# EAGLE design BEP32_90Grad (EAGLE 6.4)
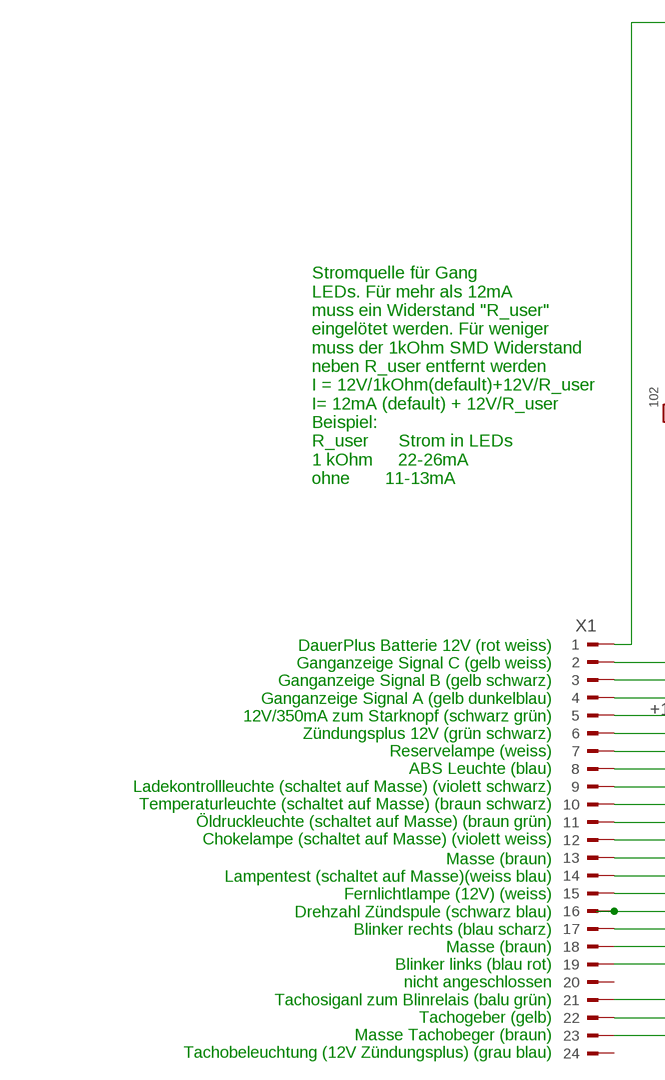
[diagram p0: schematic, sheet 1, part 1 of 2]
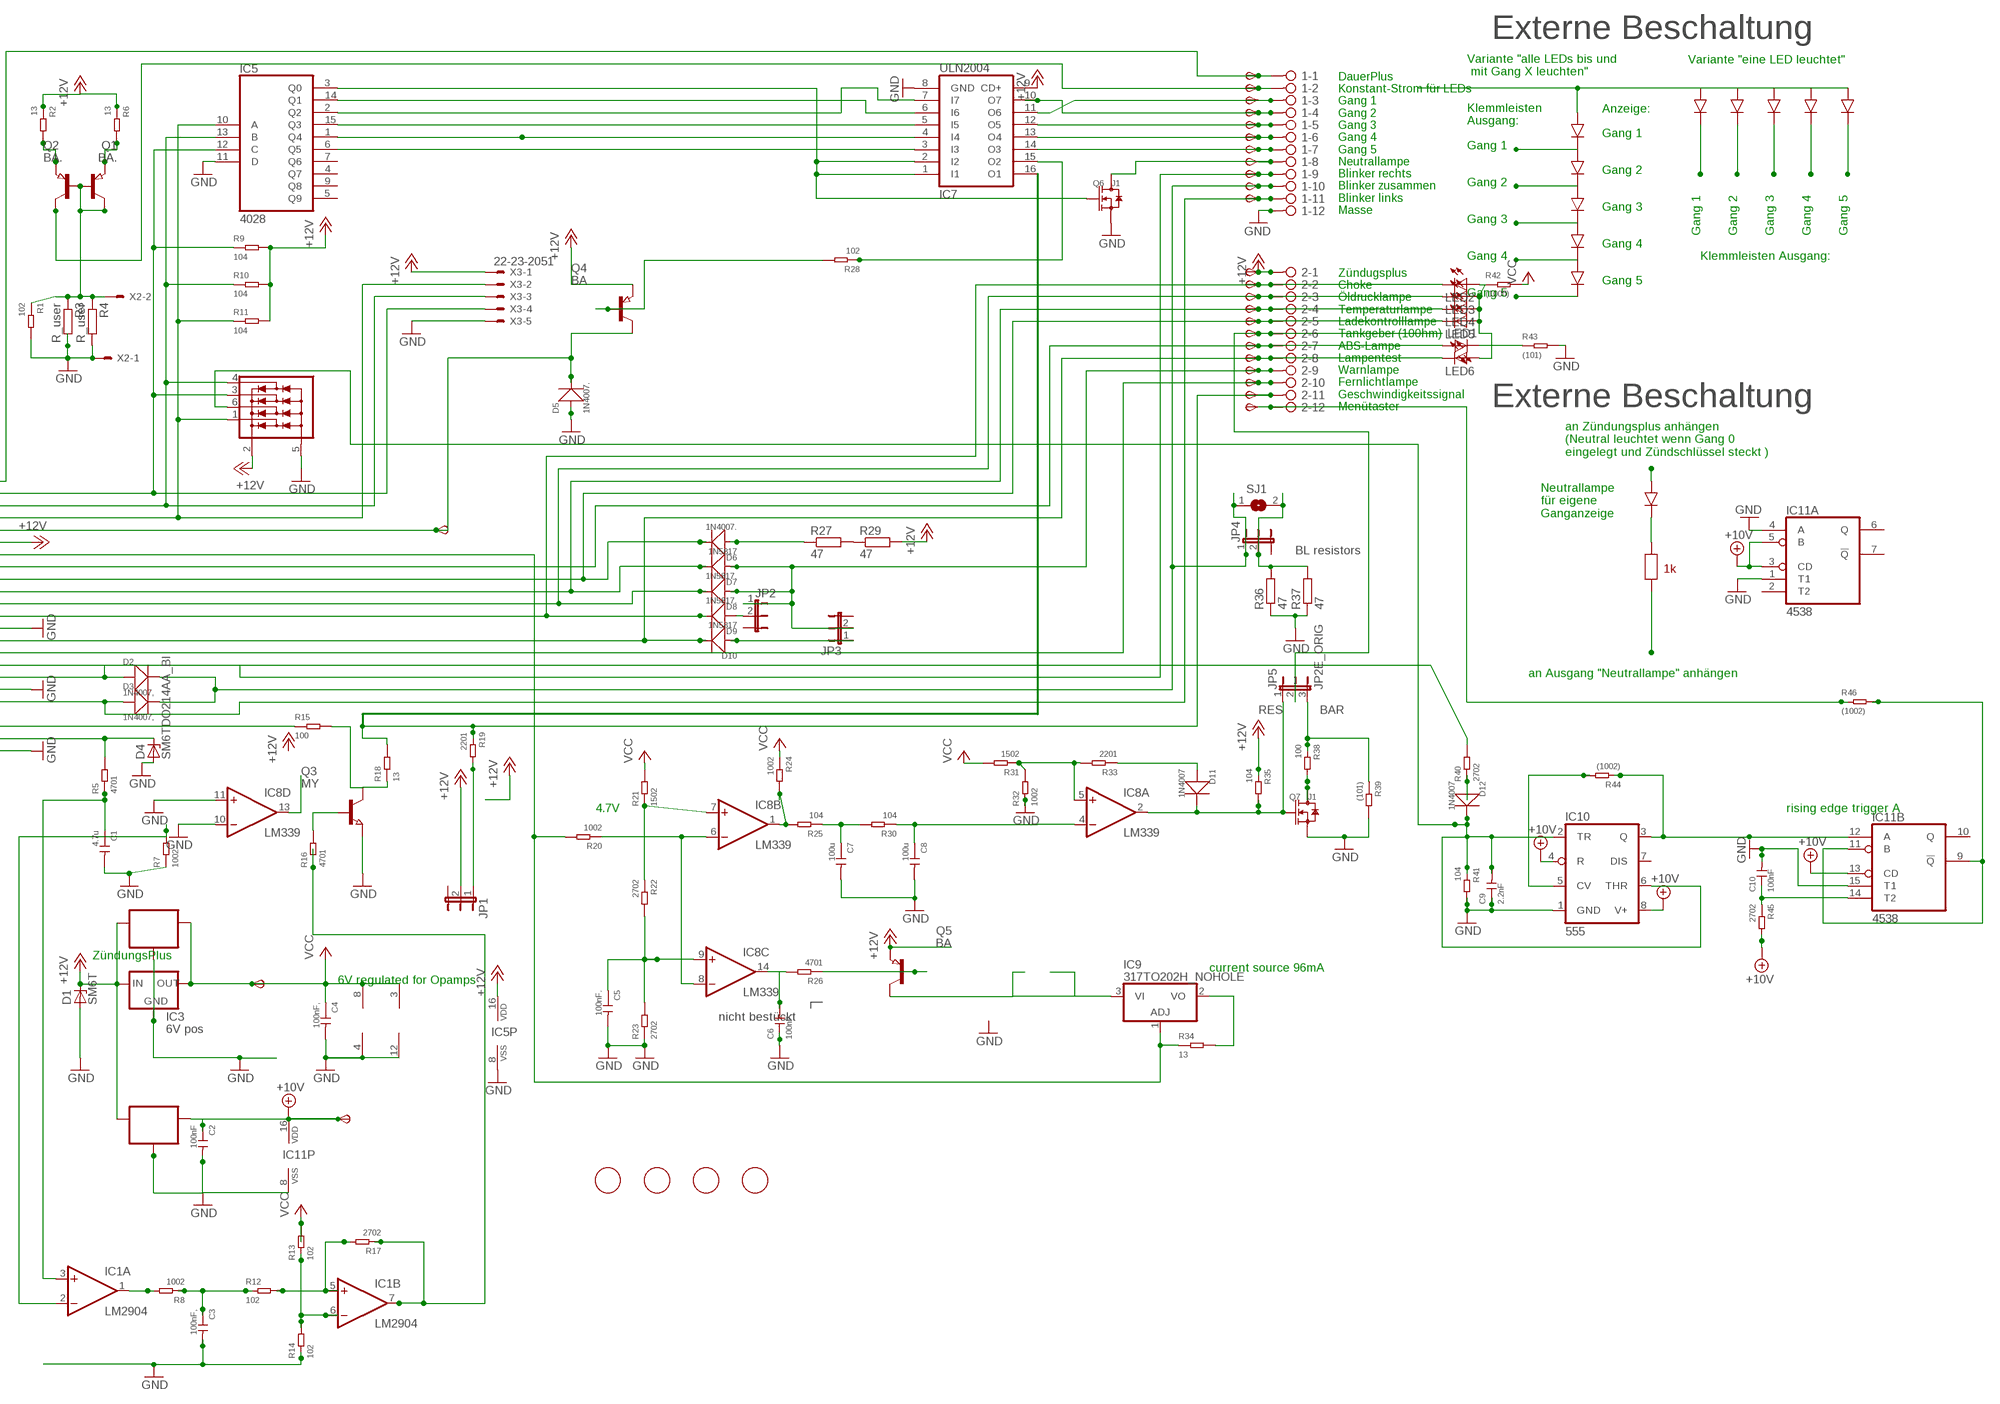
[diagram p1: schematic, sheet 1, part 2 of 2]

## Parts
1  2081-1132  [12-PIN]
2  2081-1132  [12-PIN]
6V  TPSB2.0  [B2.0]
10V  TPSB2.0  [B2.0]
C1  4.7u  CERAMIC-4.7UF-25V-10%-X5R(0805)  [C0805]
C2  100nF  CERAMIC-100NF-50V-10%-X7R(0805)  [C0805]
C3  100nF,  CERAMIC-100NF-50V-10%-X7R(0805)  [C0805]
C4  100nF,  CERAMIC-100NF-50V-10%-X7R(0805)  [C0805]
C5  100nF.  CERAMIC-100NF-50V-10%-X7R(0805)  [C0805]
C6  100nF.  CERAMIC-100NF-50V-10%-X7R(0805)  [C0805]
C7  100u  CERAMIC-100UF-6.3V-20%-X5R(1206)  [C1206]
C8  100u  CERAMIC-100UF-6.3V-20%-X5R(1206)  [C1206]
C9  2.2nF  CERAMIC-100NF-50V-10%-X7R(0805)  [C0805]
C10  100nF  CERAMIC-100NF-50V-10%-X7R(0805)  [C0805]
D1  SM6T  [DO214AA]
D2  1N4007,  DIODE-GEN-PURPOSE-1KV-1A(DO-214AC)  [DO-214AC]
D3  1N4007,  DIODE-GEN-PURPOSE-1KV-1A(DO-214AC)  [DO-214AC]
D4  SM6TDO214AA_BI  [DO214AA_BI]
D5  1N4007.  DIODE-GEN-PURPOSE-1KV-1A(DO-214AC)  [DO-214AC]
D6  1N4007.  DIODE-GEN-PURPOSE-1KV-1A(DO-214AC)  [DO-214AC]
D7  1N5817  DIODE-GEN-PURPOSE-1KV-1A(DO-214AC)DO-214AC/1206  [DO-214AC_SLIM]
D8  1N5817.  DIODE-GEN-PURPOSE-1KV-1A(DO-214AC)DO-214AC/1206  [DO-214AC_SLIM]
D9  1N5817.  DIODE-GEN-PURPOSE-1KV-1A(DO-214AC)DO-214AC/1206  [DO-214AC_SLIM]
D10  1N5817  DIODE-GEN-PURPOSE-1KV-1A(DO-214AC)DO-214AC/1206  [DO-214AC_SLIM]
D11  1N4007  DIODE-GEN-PURPOSE-1KV-1A(DO-214AC)  [DO-214AC]
D12  1N4007  DIODE-GEN-PURPOSE-1KV-1A(DO-214AC)  [DO-214AC]
FID1  FIDUCIAL  [FIDUCIAL_1MM]
FID2  FIDUCIAL  [FIDUCIAL_1MM]
FID3  FIDUCIAL  [FIDUCIAL_1MM]
FID4  FIDUCIAL  [FIDUCIAL_1MM]
IC1  LM2904  LM358D  [SO08]
IC2  78L06  78LXXSOT89_ROUND  [SOT89_ROUND]
IC3  6V pos  78LXX  [78LXX]
IC4  78L10  78LXXSOT89_ROUND  [SOT89_ROUND]
IC5  4028  4028D  [SO16]
IC6  NUP4304SOT457_R  [SOT457R_PHILIPS]
IC7  ULN2004  ULN2004AD  [SO16]
IC8  LM339  LM339D  [SO14]
IC9  317TO202H_NOHOLE  [TO220H_NOHOLE]
IC10  555  NE555D  [SO08]
IC11  4538  4538D  [SO16]
JP1  JP2EJP2_SMALLPADS  [JP2_SMALLPADS]
JP2  JP2EJP2_SMALLPADS  [JP2_SMALLPADS]
JP3  JP2EJP2_SMALLPADS  [JP2_SMALLPADS]
JP4  JP2EJP2_SMALLPADS  [JP2_SMALLPADS]
JP5  JP2E_ORIG  [JP2_ORIG_SMALLPADS]
LED1  LEDLD260  [LD260]
LED2  LEDLD260  [LD260]
LED3  LEDLD260  [LD260]
LED4  LEDLD260  [LD260]
LED5  LEDLD260  [LD260]
LED6  LEDLD260  [LD260]
Q1  BA.  PNP-TRANSISTOR_SOT89  [SOT89]
Q2  BA.  PNP-TRANSISTOR_SOT89  [SOT89]
Q3  MY  NPN-TRANSISTOR_SOT89  [SOT89]
Q4  BA  PNP-TRANSISTOR_SOT89  [SOT89]
Q5  BA  PNP-TRANSISTOR_SOT89  [SOT89]
Q6  J1  SMD-MOSFET-N-CH-50V-200MA-BSS138W-7-F(SOT-23)  [SOT-23]
Q7  J1  SMD-MOSFET-N-CH-50V-200MA-BSS138W-7-F(SOT-23)  [SOT-23]
R1  102  SMD-RES-1K-5%-1/8W(0805)  [R0805]
R2  13  SMD-RES-13R-5%-1/4W(1206)  [R1206]
R3  R_user  R-EU_R0805  [R0805]
R4  R_user  R-EU_R0805  [R0805]
R5  4701  SMD-RES-4.7K-5%-1/8W(0805)  [R0805]
R6  13  SMD-RES-13R-5%-1/4W(1206)  [R1206]
R7  1002  SMD-RES-10K-1%-1/8W(0805)  [R0805]
R8  1002  SMD-RES-10K-1%-1/8W(0805)  [R0805]
R9  104  SMD-RES-10K-1%-1/8W(0805)  [R0805]
R10  104  SMD-RES-10K-1%-1/8W(0805)  [R0805]
R11  104  SMD-RES-10K-1%-1/8W(0805)  [R0805]
R12  102  SMD-RES-1K-5%-1/8W(0805)  [R0805]
R13  102  SMD-RES-1K-5%-1/8W(0805)  [R0805]
R14  102  SMD-RES-1K-5%-1/8W(0805)  [R0805]
R15  100  SMD-RES-220R-5%-1/8W(0805)  [R0805]
R16  4701  SMD-RES-4.7K-5%-1/8W(0805)  [R0805]
R17  2702  SMD-RES-4.7K-5%-1/8W(0805)  [R0805]
R18  13  SMD-RES-13R-5%-1/4W(1206)  [R1206]
R19  2201  SMD-RES-2.2K-5%-1/8W(0805)  [R0805]
R20  1002  SMD-RES-10K-1%-1/8W(0805)  [R0805]
R21  1502  SMD-RES-10K-1%-1/8W(0805)  [R0805]
R22  2702  SMD-RES-4.7K-5%-1/8W(0805)  [R0805]
R23  2702  SMD-RES-4.7K-5%-1/8W(0805)  [R0805]
R24  1002  SMD-RES-10K-1%-1/8W(0805)  [R0805]
R25  104  SMD-RES-10K-1%-1/8W(0805)  [R0805]
R26  4701  SMD-RES-4.7K-5%-1/8W(0805)  [R0805]
R27  47  R-EU_V235/17_1MM  [V235/17_1MM]
R28  102  SMD-RES-1K-5%-1/8W(0805)  [R0805]
R29  47  R-EU_V235/17_1MM  [V235/17_1MM]
R30  104  SMD-RES-10K-1%-1/8W(0805)  [R0805]
R31  1502  SMD-RES-10K-1%-1/8W(0805)  [R0805]
R32  1002  SMD-RES-10K-1%-1/8W(0805)  [R0805]
R33  2201  SMD-RES-2.2K-5%-1/8W(0805)  [R0805]
R34  13  SMD-RES-13R-5%-1/4W(1206)  [R1206]
R35  104  SMD-RES-10K-1%-1/8W(0805)  [R0805]
R36  47  R-EU_V235/17_1MM  [V235/17_1MM]
R37  47  R-EU_V235/17_1MM  [V235/17_1MM]
R38  100  SMD-RES-2.2K-5%-1/8W(0805)  [R0805]
R39  (101)  SMD-RES-2.2K-5%-1/8W(0805)  [R0805]
R40  2702  SMD-RES-10K-1%-1/8W(0805)  [R0805]
R41  104  SMD-RES-10K-1%-1/8W(0805)  [R0805]
R42  (1000)  SMD-RES-100R-5%-1/8W(0805)  [R0805]
R43  (101)  SMD-RES-100R-5%-1/8W(0805)  [R0805]
R44  (1002)  SMD-RES-10K-1%-1/8W(0805)  [R0805]
R45  2702  SMD-RES-4.7K-5%-1/8W(0805)  [R0805]
R46  (1002)  SMD-RES-4.7K-5%-1/8W(0805)  [R0805]
SJ1  SJ  [SJ]
START  TPSB2.0  [B2.0]
TP1  TPSB2.0  [B2.0]
TP2  TPSB2.0  [B2.0]
TP3  TPSB2.0  [B2.0]
TP4  TPSB2.0  [B2.0]
TP5  TPSB2.0  [B2.0]
TP6  TPSB2.0  [B2.0]
TP7  TPSB2.0  [B2.0]
TP8  TPSB2.0  [B2.0]
TP9  TPSB2.0  [B2.0]
TP10  TPSB2.0  [B2.0]
TP11  TPSB2.0  [B2.0]
TP12  TPSB2.0  [B2.0]
TP13  TPSB2.0  [B2.0]
TP16  TPSB2.0  [B2.0]
TP17  TPSB2.0  [B2.0]
TP18  TPSB2.0  [B2.0]
TP19  TPSB2.0  [B2.0]
TP21  TPSB2.0  [B2.0]
TP22  TPSB2.0  [B2.0]
TP23  TPSB2.0  [B2.0]
TP24  TPSB1,27  [B1,27]
TP25  TPSB2.0  [B2.0]
TP26  TPSB2.0  [B2.0]
X1  CON_BMWV2  [24-PIN_V2]
X2  22-23-2021  [22-23-2021]
X3  22-23-2051  [22-23-2051]

## Nets
+10V: 10V.TP(PP) C2.1 IC4.1(OUT) IC10.4(R) IC10.8(V+) IC11.3(A:CD) IC11.5(A:B) IC11.13(B:CD) IC11.16(P:VDD) R45.2
+12V: 2.1 D1.C IC2.3(IN) IC3.IN IC4.3(IN) IC5.16(VDD) IC6.2(V+) IC7.9(CD+) JP1.2 Q4.3(E) Q5.3(E) R2.1 R6.1 R9.2 R10.2 R11.2 R29.2 R35.1 TP12.TP(PP) X1.6 X3.1
+12V1: IC1.7(B:OUT) R16.1 R17.1
GND: 1.12 C1.2 C2.2 C3.2 C4.2 C5.2 C6.1 C7.2 C8.2 C9.1 C10.2 D1.A D4.A D5.1(+) IC1.4(P:V-) IC2.2(GND) IC2.2@1(GND) IC3.GND IC4.2(GND) IC4.2@1(GND) IC5.8(VSS) IC5.11(D) IC6.5(V-) IC7.8(GND) IC8.10(D:-IN) IC8.11(D:+IN) IC8.12(P:GND) IC10.1(GND) IC11.1(A:T1) IC11.4(A:A) IC11.8(P:VSS) IC11.15(B:T1) Q3.3(E) Q6.2(S) Q7.2(S) R1.2 R3.2 R4.2 R7.1 R14.1 R23.1 R32.1 R36.1 R37.1 R39.2 R41.2 R43.2 X1.13 X1.18 X1.23 X2.1 X3.5
N$1: 2.9 D7.1(+) D8.1(+) JP2.1 JP3.2 TP24.TP(PP)
N$2: IC5.10(A) IC6.1(D1) R11.1 X1.4 X3.2
N$3: IC5.13(B) IC6.4(D4) R10.1 X1.3 X3.3
N$4: 2.7 LED1.A TP22.TP(PP) X1.8
N$5: Q1.3(E) R2.2
N$6: D11.2(-) IC8.2(A:OUT) JP5.1 Q7.1(G) R35.2
N$7: IC1.2(A:-IN) R7.2
N$8: R27.2 R29.1
N$9: Q2.3(E) R6.2
N$11: D5.2(-) Q4.2(C) START.TP(PP) X1.5
N$12: 2.2 D9.2(-) LED2.K(C) TP16.TP(PP) X1.12
N$13: 2.3 D8.2(-) LED3.K(C) TP17.TP(PP) X1.11
N$14: 2.4 D7.2(-) LED4.K(C) TP18.TP(PP) X1.10
N$15: IC9.3(VI) Q5.2(C)
N$16: IC8.6(B:-IN) IC8.8(C:-IN) R20.1
N$17: IC5.12(C) IC6.3(D3) R9.1 X1.2 X3.4
N$18: IC5.15(Q3) IC7.5(I5)
N$19: 2.8 D10.2(-) LED6.K(C) TP23.TP(PP) X1.14
N$20: 1.9 D2.1(+) TP9.TP(PP) X1.17
N$21: 1.11 D3.1(+) TP11.TP(PP) X1.19
N$22: IC11.9(B:!Q) IC11.11(B:B) R46.2
N$23: D4.C R5.2 X1.22
N$24: C1.1 IC1.3(A:+IN) R5.1
N$25: 1.6 IC7.13(O4) TP6.TP(PP)
N$26: 1.7 IC7.14(O3) TP7.TP(PP)
N$27: 2.11 IC7.16(O1) R18.2 R19.1 TP26.TP(PP)
N$28: 2.6 JP5.2 TP21.TP(PP)
N$29: JP1.1 R19.2
N$30: C5.1 IC8.9(C:+IN) R22.2 R23.2
N$31: C6.2 IC8.14(C:OUT) R26.2
N$32: C9.2 D12.2(-) IC6.6(D2) IC10.2(TR) IC10.6(THR) R41.1
N$34: LED1.K(C) R43.1
N$35: IC9.1(ADJ) R20.2 R34.1 X1.7
N$36: Q5.1(B) R26.1
N$37: IC5.2(Q2) IC7.7(I7)
N$38: 1.3 IC7.11(O6) TP3.TP(PP)
N$39: 1.5 IC7.12(O5) TP5.TP(PP)
N$41: LED2.A LED3.A LED4.A LED5.A LED6.A R42.1
N$42: R40.2 X1.16
N$43: Q4.1(B) R28.2
N$44: IC5.3(Q0) IC7.1(I1) IC7.2(I2) Q6.1(G)
N$45: C7.1 R25.1 R30.2
N$46: C8.1 IC8.4(A:-IN) R30.1
N$47: IC8.5(A:+IN) R31.1 R32.2 R33.2
N$48: Q7.3(D) R38.2
N$49: D11.1(+) R33.1
N$50: IC5.1(Q4) IC7.4(I4)
N$51: R15.1 X1.21
N$52: 1.8 Q6.3(D) TP8.TP(PP)
N$53: 2.10 TP25.TP(PP) X1.15
N$54: D6.1(+) R27.1
N$55: 2.5 D6.2(-) LED5.K(C) TP19.TP(PP) X1.9
N$56: IC5.14(Q1) IC7.6(I6)
N$57: Q1.1(B) Q2.1(B) Q2.2(C) R1.1 R3.1 R4.1 X2.2
N$58: Q3.2(C) R15.2 R18.1
N$59: 1.2 Q1.2(C) TP2.TP(PP)
N$60: IC8.13(D:OUT)
N$61: IC5.6(Q5) IC7.3(I3)
N$64: IC9.2(VO) R34.2
N$65: IC10.5(CV) R44.2
N$67: 1.4 IC7.10(O7) TP4.TP(PP)
N$69: 1.1 TP1.TP(PP) X1.1
N$83: IC8.7(B:+IN) R21.1 R22.1
N$85: Q3.1(B) R16.2
N$86: IC10.3(Q) IC11.12(B:A) R44.1
N$87: D12.1(+) R40.1
N$88: IC7.15(O2) R28.1
N$89: C10.1 IC11.14(B:T2) R45.1
N$90: 2.12 R46.1 TP13.TP(PP)
N$92: IC1.1(A:OUT) R8.2
N$93: 1.10 D2.2(-) D3.2(-) JP4.1 SJ1.1 TP10.TP(PP)
N$94: JP4.2 R36.2 R37.2 SJ1.2
N$95: D9.1(+) JP2.2
N$96: C3.1 R8.1 R12.1
N$97: IC1.5(B:+IN) R12.2 R17.2
N$98: D10.1(+) JP3.1
N$99: JP5.3 R38.1 R39.1
N$101: IC1.6(B:-IN) R13.1 R14.2
N$580: IC8.1(B:OUT) R24.2 R25.2
VCC: 6V.TP(PP) C4.1 IC1.8(P:V+) IC2.1(OUT) IC3.OUT IC8.3(P:V+) R13.2 R21.2 R24.1 R31.2 R42.2
Unconnected: IC5.4(Q7) IC5.5(Q9) IC5.7(Q6) IC5.9(Q8) IC10.7(DIS) IC11.2(A:T2) IC11.6(A:Q) IC11.7(A:!Q) IC11.10(B:Q) X1.20 X1.24

## Notes on the sheet
- Externe Beschaltung
- Variante "eine LED leuchtet"
- Variante "alle LEDs bis und
   mit Gang X leuchten"
- Anzeige:
- Klemmleisten
  Ausgang:
- Gang 1
- DauerPlus
  Konstant-Strom für LEDs
  Gang 1
  Gang 2
  Gang 3
  Gang 4
  Gang 5
  Neutrallampe
  Blinker rechts
  Blinker zusammen
  Blinker links
  Masse
- Gang 1
- Gang 2
- Gang 2
- Gang 3
- Gang 3
- Gang 1 | Gang 2 | Gang 3 | Gang 4 | Gang 5
- Gang 4
- Gang 4 | Klemmleisten Ausgang:
- Gang 5
- Gang 5
- Zündugsplus
  Choke
  Öldrucklampe
  Temperaturlampe
  Ladekontrolllampe
  Tankgeber (100hm)
  ABS-Lampe
  Lampentest
  Warnlampe
  Fernlichtlampe
  Geschwindigkeitssignal
  Menütaster
- Stromquelle für Gang
  LEDs. Für mehr als 12mA
  muss ein Widerstand "R_user"
  eingelötet werden. Für weniger
  muss der 1kOhm SMD Widerstand
  neben R_user entfernt werden
  I = 12V/1kOhm(default)+12V/R_user
  I= 12mA (default) + 12V/R_user
  Beispiel:
  R_user      Strom in LEDs
  1 kOhm     22-26mA
  ohne       11-13mA
- Externe Beschaltung
- an Zündungsplus anhängen
  (Neutral leuchtet wenn Gang 0
  eingelegt und Zündschlüssel steckt )
- Neutrallampe
  für eigene
  Ganganzeige
- DauerPlus Batterie 12V (rot weiss)
  Ganganzeige Signal C (gelb weiss)
  Ganganzeige Signal B (gelb schwarz)
  Ganganzeige Signal A (gelb dunkelblau)
  12V/350mA zum Starknopf (schwarz grün)
  Zündungsplus 12V (grün schwarz)
  Reservelampe (weiss)
  ABS Leuchte (blau)
  Ladekontrollleuchte (schaltet auf Masse) (violett schwarz)
  Temperaturleuchte (schaltet auf Masse) (braun schwarz)
  Öldruckleuchte (schaltet auf Masse) (braun grün)
  Chokelampe (schaltet auf Masse) (violett weiss)
- BL resistors
- 1k
- an Ausgang "Neutrallampe" anhängen
- Masse (braun)
  Lampentest (schaltet auf Masse)(weiss blau)
  Fernlichtlampe (12V) (weiss)
  Drehzahl Zündspule (schwarz blau)
  Blinker rechts (blau scharz)
  Masse (braun)
  Blinker links (blau rot)
  nicht angeschlossen
  Tachosiganl zum Blinrelais (balu grün)
  Tachogeber (gelb)
  Masse Tachobeger (braun)
  Tachobeleuchtung (12V Zündungsplus) (grau blau)
- RES | BAR
- 4.7V | rising edge trigger A
- ZündungsPlus
- current source 96mA
- 6V regulated for Opamps
- nicht bestückt

## Library data of the parts
1 2 = con WAGO BMW:2081-1132: WAGO SREW CLAMP
6V 10V START TP1-TP13 TP16-TP19 TP21-TP26 = testpin_BMW:TPS: TEST PIN
C1 = Seeed-Capacitor-2016:CERAMIC-4.7UF-25V-10%-X5R(0805): 302010146; MPN: CC0805KKX5R8BB475; VALUE: 4.7uf
C2-C6 C9 C10 = Seeed-Capacitor-2016:CERAMIC-100NF-50V-10%-X7R(0805): 302010165; MPN: CC0805KRX7R9BB104; VALUE: 100nf
C7 C8 = Seeed-Capacitor-2016:CERAMIC-100UF-6.3V-20%-X5R(1206): 302010183; MPN: GRM31CR60J107ME39L; VALUE: 100uf
D1 D4 = Suppressor_Diode_DO214AA:SM6T: Z DIODE
D2 D3 D5 D6 = Diode-do214ac:DIODE-GEN-PURPOSE-1KV-1A(DO-214AC): 304010013; MPN: 1N4007; VALUE: 1N4007
D7-D10 = Diode-do214ac:DIODE-GEN-PURPOSE-1KV-1A(DO-214AC): 304010013
D11 D12 = Diode-do214ac:DIODE-GEN-PURPOSE-1KV-1A(DO-214AC): 304010013; MPN: 1N4007
FID1-FID4 = Fiducial:FIDUCIAL: For use by pick and place machines to calibrate the vision/machine, 1mm By microbuilder.eu
IC1 = linear_BMW:LM358: OP AMP also LM158; LM258; LM2904 Source: http://cache.national.com/ds/LM/LM158.pdf
IC2 IC4 = 78LXX:78LXX
IC3 = v-reg:78LXX: VOLTAGE REGULATOR
IC5 = 4028:4028: BCD to decimal DECODER
IC6 = NUP4304_ESD_Diode_Array:NUP4304
IC7 = uln-udn:ULN2004A: DRIVER ARRAY
IC8 = LM339:LM339: Low Power Low Offset Voltage Quad Comparators with open collector; LM139/LM239/LM339/LM2901/LM3302
IC9 = linear_BMW:*317: Positive VOLTAGE REGULATOR
IC10 = linear:*555: TIMER
IC11 = 45xx:4538: Dual precision monostable MULTIVIBRATOR
JP1-JP4 = Switch Aliexpress 2:JP2E: JUMPER
JP5 = Switch Aliexpress 2:JP2E_ORIG
LED1-LED6 = led:LED: LED OSRAM: - CHIPLED LG R971, LG N971, LY N971, LG Q971, LY Q971, LO R971, LY R971 LH N974, LH R974 LS Q976, LO Q976, LY Q976 LO Q996 - Hyper CHIPLED LW Q18S LB Q993, LB Q99A, LB R99A - SideLED LS A670, LO A670, LY A670, LG A670, LP A670 LB A673, LV A673, LT A673, LW A673 LH A674 LY A675 LS A676, LA A676, LO A676, LY A676, LW A676 LS A679, LY A679, LG A679 - Hyper Micro SIDELED® LS Y876, LA Y876, LO Y876, LY Y876 LT Y87S - SmartLED LW L88C, LW L88S LB L89C, LB L89S, LG L890 LS L89K, LO L89K, LY L89K LS L896, LA L896, LO L896, LY L896 - TOPLED LS T670, LO T670, LY T670, LG T670, LP T670 LSG T670, LSP T670, LSY T670, LOP T670, LYG T670 LG T671, LOG T671, LSG T671 LB T673, LV T673, LT T673, LW T673 LH T674 LS T676, LA T676, LO T676, LY T676, LB T676, LH T676, LSB T676, LW T676 LB T67C, LV T67C, LT T67C, LS T67K, LO T67K, LY T67K, LW E67C LS E67B, LA E67B, LO E67B, LY E67B, LB E67C, LV E67C, LT E67C LW T67C LS T679, LY T679, LG T679 LS T770, LO T770, LY T770, LG T770, LP T770 LB T773, LV T773, LT T773, LW T773 LH T774 LS E675, LA E675, LY E675, LS T675 LS T776, LA T776, LO T776, LY T776, LB T776 LHGB T686 LT T68C, LB T68C - Hyper Mini TOPLED® LB M676 - Mini TOPLED Santana® LG M470 LS M47K, LO M47K, LY M47K Source: http://www.osram.convergy.de LUXEON: - LUMILED® LXK2-PW12-R00, LXK2-PW12-S00, LXK2-PW14-U00, LXK2-PW14-V00 LXK2-PM12-R00, LXK2-PM12-S00, LXK2-PM14-U00 LXK2-PE12-Q00, LXK2-PE12-R00, LXK2-PE12-S00, LXK2-PE14-T00, LXK2-PE14-U00 LXK2-PB12-K00, LXK2-PB12-L00, LXK2-PB12-M00, LXK2-PB14-N00, LXK2-PB14-P00, LXK2-PB14-Q00 LXK2-PR12-L00, LXK2-PR12-M00, LXK2-PR14-Q00, LXK2-PR14-R00 LXK2-PD12-Q00, LXK2-PD12-R00, LXK2-PD12-S00 LXK2-PH12-R00, LXK2-PH12-S00 LXK2-PL12-P00, LXK2-PL12-Q00, LXK2-PL12-R00 Source: www.luxeon.com KINGBRIGHT: KA-3528ASYC Source: www.kingbright.com
Q1 Q2 Q4 Q5 = Transistor_SOT89:PNP-TRANSISTOR_: PNP TRANSISTOR
Q3 = Transistor_SOT89:NPN-TRANSISTOR_: NPN TRANSISTOR
Q6 Q7 = Seeed-Transistor-2016:SMD-MOSFET-N-CH-50V-200MA-BSS138W-7-F(SOT-23): 305030000; MPN: BSS138W-7-F; VALUE: BSS138W-7-F
R1 R12-R14 R28 = Seeed-Resistor-2016:SMD-RES-1K-5%-1/8W(0805): 301010311; MPN: RC0805JR-071KL; VALUE: 1K
R2 R6 R18 R34 = Seeed-Resistor-2016:SMD-RES-13R-5%-1/4W(1206): 301010405; MPN: RC1206JR-0713RL; VALUE: 13R
R3 R4 R27 R29 R36 R37 = rcl:R-EU_: RESISTOR, European symbol
R5 R16 R17 R22 R23 R26 R45 R46 = Seeed-Resistor-2016:SMD-RES-4.7K-5%-1/8W(0805): 301010306; MPN: RC0805JR-074K7L; VALUE: 4.7K
R7-R11 R20 R21 R24 R25 R30-R32 R35 R40 R41 R44 = Seeed-Resistor-2016:SMD-RES-10K-1%-1/8W(0805): 301010361; MPN: RC0805FR-0710KL; VALUE: 10K
R15 = Seeed-Resistor-2016:SMD-RES-220R-5%-1/8W(0805): 301010315; MPN: RC0805JR-07220RL; VALUE: 220R
R19 R33 R38 R39 = Seeed-Resistor-2016:SMD-RES-2.2K-5%-1/8W(0805): 301010333; MPN: RC0805JR-072K2L; VALUE: 2.2K
R42 R43 = Seeed-Resistor-2016:SMD-RES-100R-5%-1/8W(0805): 301010319; MPN: RC0805JR-07100RL; VALUE: 100R
SJ1 = solder-jumper:SJ: SMD solder JUMPER
X1 = con_BMW:CON_BMW: BMW CONNECTOR
X2 = con_Molex_BMW:22-23-2021: .100" (2.54mm) Center Header - 2 Pin; MF: MOLEX; MPN: 22-23-2021; OC_FARNELL: 1462926; OC_NEWARK: 25C3832
X3 = con_Molex_BMW:22-23-2051: .100" (2.54mm) Center Header - 5 Pin; MF: MOLEX; MPN: 22-23-2051; OC_FARNELL: 1462952; OC_NEWARK: 38C9178

## Board
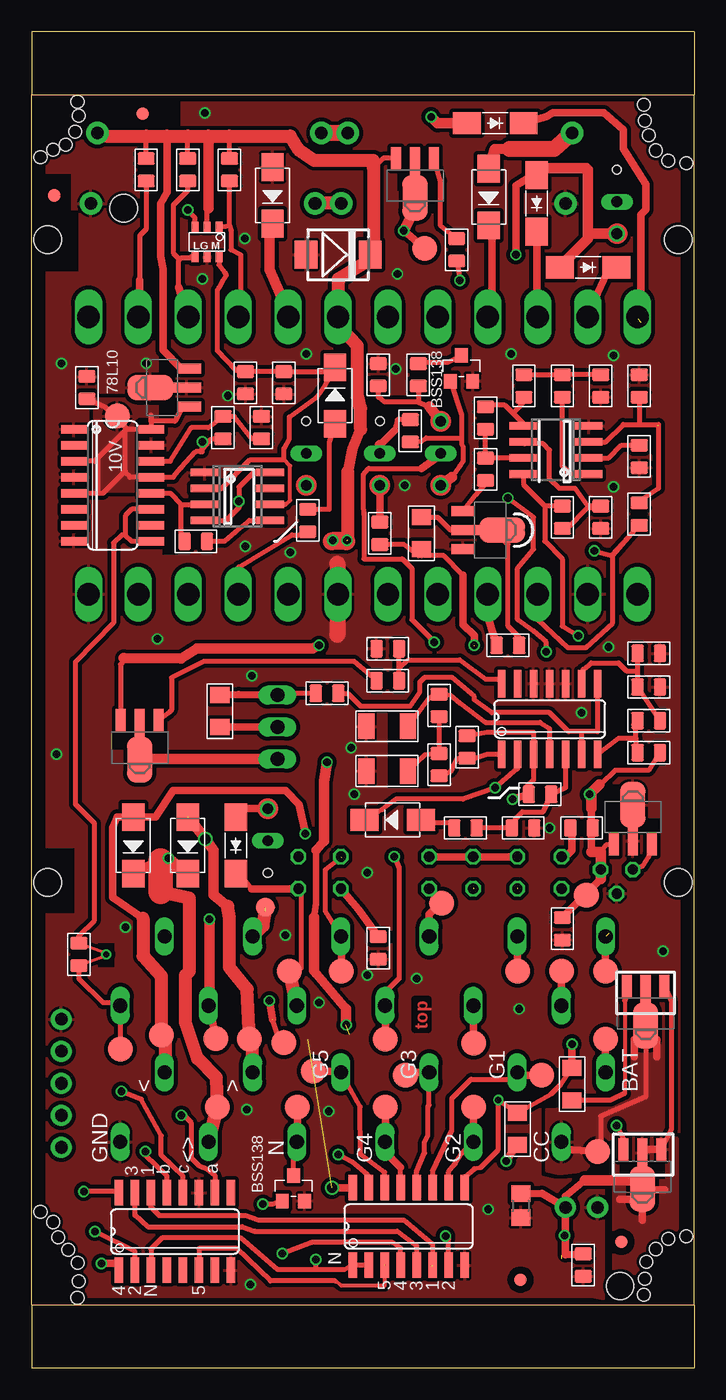
[diagram p2: board, top side]
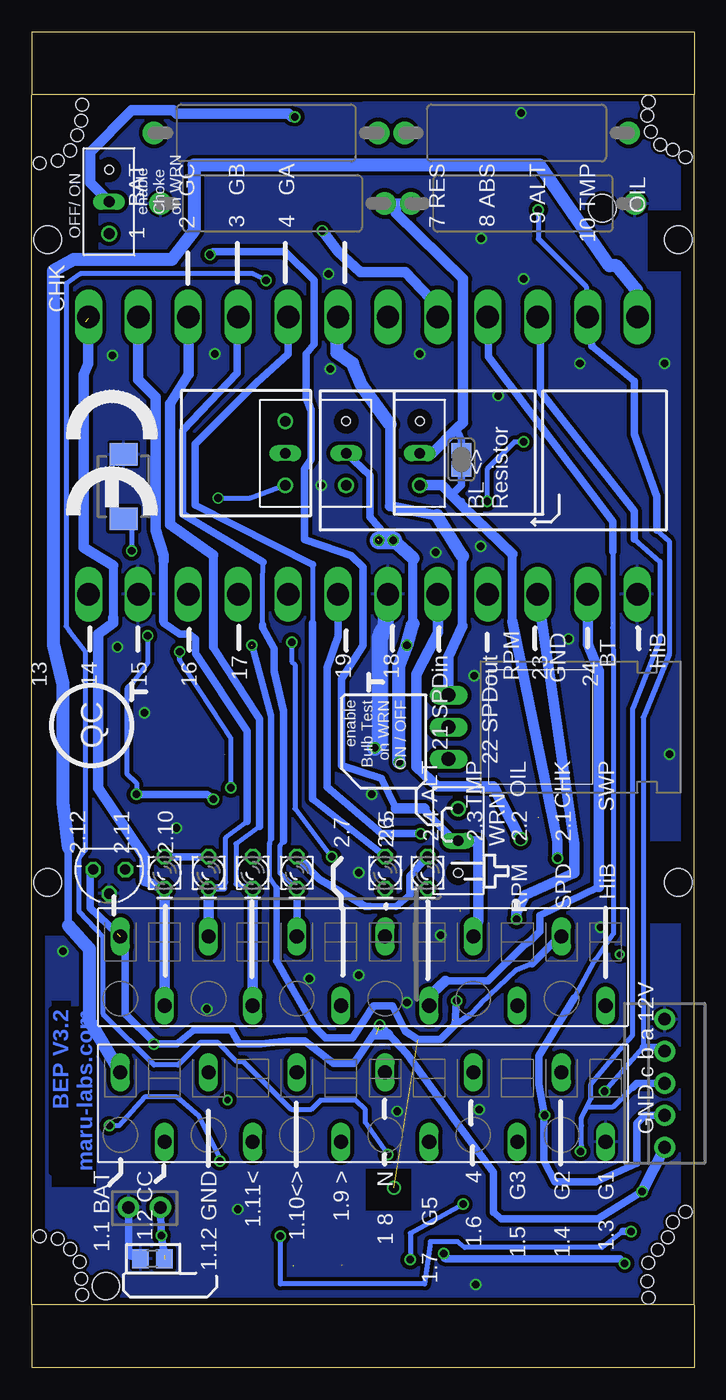
[diagram p3: board, bottom side, seen from below]

Size 52.6 x 106 mm. Coordinates in mm from the lower left corner, seen from the top.
Outline: 0,101 52.6,101
Outline: 52.6,5 52.6,101
Outline: 0,5 0,101
Outline: 0,5 52.6,5
Outline: 0,5 0,0 52.6,0 52.6,5
Outline: 52.6,101 52.6,106 0,106 0,101
Copper layers (1*16): Top 0.035mm / dielectric 1.5mm / Bottom 0.035mm
Design rules "multi-cb_035um-cu *": minimum track width 6mil, minimum drill 12mil, track to track 12mil, track to pad 12mil, pad to pad 6mil, via to via 6mil, smd to smd 6mil, copper to edge 10mil, drill to drill 8mil, minimum pad ring 8mil, minimum via ring 6mil, stop-mask expansion 3mil, vias tented up to drill 0mil, thermal gap 8mil
Holes 1.02 mm at 48.59,5.81 48.66,7.08 48.77,8.43 49.55,9.43 50.53,10.24 3.64,100.45 3.73,99.31 3.47,98.04 2.71,97.03 48.59,100.19 48.66,98.92 48.97,97.77 49.55,96.57 50.53,95.76 3.64,5.55 3.73,6.89 3.67,8.36 2.91,9.37 1.71,96.63 0.71,96.03 2.11,10.37 1.71,11.57 0.71,12.37 51.93,10.44 51.93,95.56
Holes 2.18 mm at 46.7,6.5 7.3,92
Holes 2.2 mm at 51.3,89.5 51.3,38.5 1.3,38.5 1.3,89.5
tRestrict: area 28.3,46 to 31.6,52.5; area 5.3,31.8 to 6.6,33.7; area 34,63.4 to 36,65.2; area 6.4,49.1 to 10.7,50.5; area 45.4,42.3 to 49.9,43.6; area 45.5,43.6 to 46.7,46.3; area 46.7,15 to 50.2,16.4; area 10.1,75.3 to 11.4,80; area 29,93.4 to 30.2,95; area 14.4,86.1 to 14.6,87.2; area 9.6,98.5 to 11.8,100.4; area 0.4,91.4 to 3.1,94.7; 3 more areas
bRestrict: area 47.5,14.4 to 51,24.6; area 49.5,24.5 to 51,29.1; area 49.5,34.3 to 51.7,40.8; area 1.1,35.3 to 3.5,41.8; area 47.3,86.6 to 51.1,92.6; area 22.5,12.5 to 26.1,15.8; area 0.7,87 to 3.7,91.8

### Footprints (pad centres in the part's own frame; a part is rotated, then mirrored left to right if it is on the bottom)
12-PIN = drill 1.118 long: 1 19.25,-2.45; 2 15.75,3.05; 3 12.25,-2.45; 4 8.75,3.05; 5 5.25,-2.45; 6 1.75,3.05; 7 -1.75,-2.45; 8 -5.25,3.05; 9 -8.75,-2.45; 10 -12.25,3.05; 11 -15.75,-2.45; 12 -19.25,3.05
B2.0 = smd 2 x 2: TP 0,0
C0805 = smd 1.397 x 1.016: 1 0,0.889; 2 0,-0.889
C1206 = smd 1.27 x 2.032: 1 -1.651,0; 2 1.651,0
DO214AA = smd 1.8 x 2.2: A 2.55,0; C -2.55,0
DO-214AC = smd 2.2 x 1.77: 1 -2.242,0; 2 2.242,0
DO214AA_BI = smd 1.8 x 2.2: A 2.45,0; C -2.65,0
DO-214AC_SLIM = smd 2.2 x 1.77: 1 -2.242,0; 2 2.242,0
FIDUCIAL_1MM = smd 1 x 1: 1 0,0
SO08 = smd 0.6 x 2.2: 1 -1.905,-2.6; 2 -0.635,-2.6; 3 0.635,-2.6; 4 1.905,-2.6; 5 1.905,2.6; 6 0.635,2.6; 7 -0.635,2.6; 8 -1.905,2.6
SOT89_ROUND = smd 0.8 x 1.8: 1 -1.499,-2.181; 3 1.499,-2.181 | smd 0.8 x 2.3: 2 0,-1.927 | smd 2.032 x 3.65: 2@1 0,0.94
78LXX = drill 0.813 octagon: GND 0,1.905; IN 1.27,0; OUT -1.27,0
SO16 = smd 0.66 x 2.032: 1 -4.445,-3.073; 2 -3.175,-3.073; 3 -1.905,-3.073; 4 -0.635,-3.073; 5 0.635,-3.073; 6 1.905,-3.073; 7 3.175,-3.073; 8 4.445,-3.073; 9 4.445,3.073; 10 3.175,3.073; 11 1.905,3.073; 12 0.635,3.073; 13 -0.635,3.073; 14 -1.905,3.073; 15 -3.175,3.073; 16 -4.445,3.073
SOT457R_PHILIPS = smd 0.55 x 0.8: 1 -0.95,-1.2; 2 0,-1.2; 3 0.95,-1.2; 4 0.95,1.2; 5 0,1.2; 6 -0.95,1.2
SO14 = smd 0.6 x 2.2: 1 -3.81,-2.8; 2 -2.54,-2.8; 3 -1.27,-2.8; 4 0,-2.8; 5 1.27,-2.8; 6 2.54,-2.8; 7 3.81,-2.8; 8 3.81,2.8; 9 2.54,2.8; 10 1.27,2.8; 11 0,2.8; 12 -1.27,2.8; 13 -2.54,2.8; 14 -3.81,2.8
TO220H_NOHOLE = drill 1.118 long: 1 -2.54,-10.16; 2 0,-10.16; 3 2.54,-10.16
JP2_SMALLPADS = drill 0.85: 1 -2.54,0 | drill 0.85 long: 2 0,0 | hole 0.7: 2.54,0
JP2_ORIG_SMALLPADS = drill 0.85: 1 -2.54,0; 3 2.54,0 | drill 0.85 long: 2 0,0
LD260 = drill 0.813 octagon: A -1.27,0; K 1.27,0
SOT89 = smd 0.8 x 1.8: 1 -1.499,-2.181; 3 1.499,-2.181 | smd 0.8 x 2.3: 2 0,-1.927 | smd 2.032 x 3.65: 2@1 0,0.94
SOT-23 = smd 1.016 x 1.143: 1 -0.889,-1.016; 2 0.889,-1.016; 3 0,1.016
R0805 = smd 1.397 x 1.016: 1 0,0.889; 2 0,-0.889
R1206 = smd 1.27 x 1.524: 1 -1.27,0; 2 1.27,0
R0805' = smd 1.3 x 1.5: 1 -0.95,0; 2 0.95,0
V235/17_1MM = drill 1 pad 1.778: 1 -8.89,0; 2 8.89,0
SJ = smd 1.2 x 1.6: 1 -0.725,0; 2 0.725,0
B1,27 = smd 1.5 x 1.5: TP 0,0
24-PIN_V2 = drill 1.778 long: 1 -21.78,-11; 2 -17.82,-11; 3 -13.86,-11; 4 -9.9,-11; 5 -5.94,-11; 6 -1.98,-11; 7 1.98,-11; 8 5.94,-11; 9 9.9,-11; 10 13.86,-11; 11 17.82,-11; 12 21.78,-11; 13 -21.78,11; 14 -17.82,11; 15 -13.86,11; 16 -9.9,11; 17 -5.94,11; 18 -1.98,11; 19 1.98,11; 20 5.94,11; 21 9.9,11; 22 13.86,11; 23 17.82,11; 24 21.78,11
22-23-2021 = drill 1 pad 1.676: 1 -1.27,0; 2 1.27,0
22-23-2051 = drill 1 pad 1.676: 1 -5.08,0; 2 -2.54,0; 3 0,0; 4 2.54,0; 5 5.08,0

### Placement (x,y rotation side)
1  26.3,20.99 180 bottom
2  26.3,31.79 180 bottom
6V  44.02,37.5 90 top
10V  6.8,75.5 90 top
C1  48.21,77.89 180 top
C2  4.4,77.76 180 top
C3  45.16,77.89 0 top
C4  42.12,34.83 0 top
C5  48.97,54.01 90 top
C6  28.27,57.06 90 top
C7  28.21,47.34 180 top
C8  28.21,50.9 180 top
C9  20.02,78.14 180 top
C10  18.24,74.58 180 top
D1  24.34,88.3 180 top
D2  12.4,41.44 270 top
D3  8.08,41.44 270 top
D4  45.29,70.01 90 bottom
D5  19.13,93 270 top
D6  36.27,92.87 270 top
D7  40.08,92.36 270 top
D8  44.16,87.3 0 top
D9  36.79,98.73 0 top
D10  16.21,41.44 270 top
D11  28.65,43.47 180 top
D12  24.08,77.12 90 top
FID1  8.8,99.5 90 top
FID2  38.8,7 90 top
FID3  46.8,10 90 top
FID4  1.8,93 90 top
IC1  41.61,72.81 90 top
IC2  47.7,43.72 0 top
IC3  46.43,39.53 180 bottom
IC4  10.37,77.76 90 top
IC5  11.38,10.83 0 top
IC6  13.92,89.32 180 top
IC7  29.92,11.23 0 top
IC8  41.1,51.47 0 top
IC9  9.35,50.84 270 bottom
IC10  16.34,69.12 270 top
IC11  6.43,70.01 270 top
JP1  27.64,72.55 90 bottom
JP2  46.45,92.5 90 bottom
JP3  18.75,41.82 270 bottom
JP4  21.8,72.55 90 bottom
JP5  32.46,72.55 90 bottom
LED1  24.55,39.28 270 bottom
LED2  42.05,39.28 270 bottom
LED3  38.55,39.28 270 bottom
LED4  35.05,39.28 270 bottom
LED5  31.55,39.28 270 bottom
LED6  21.18,39.28 270 bottom
Q1  48.72,28.1 180 top
Q2  48.47,15.15 180 top
Q3  36.4,66.46 270 top
Q4  30.43,93.76 180 top
Q5  8.59,49.18 180 top
Q6  20.78,14.26 0 top
Q7  34.12,79.28 0 top
R1  43.77,8.16 0 top
R2  42.88,22.51 270 top
R3  R_user  [R0805']  38.81,12.87 270 top
R4  R_user  [R0805']  43.01,8.67 180 bottom
R5  48.21,67.73 0 top
R6  38.56,18.96 270 top
R7  48.21,72.3 180 top
R8  42.12,77.89 0 top
R9  9.1,95.03 180 top
R10  12.4,95.03 180 top
R11  15.7,95.03 180 top
R12  39.07,77.89 0 top
R13  42.12,67.47 180 top
R14  45.16,67.47 180 top
R15  37.8,57.31 90 top
R16  36.02,71.28 0 top
R17  36.02,75.35 180 top
R18  30.94,66.21 270 top
R19  27.64,66.2 180 top
R20  23.45,53.5 270 top
R21  48.97,48.8 90 top
R22  48.97,51.34 90 top
R23  48.97,56.68 270 top
R24  34.56,49.25 0 top
R25  32.34,47.85 0 top
R26  28.27,54.52 90 top
R27  33.99,97.95 0 bottom
R28  33.73,88.68 180 top
R29  14.11,97.95 0 bottom
R30  32.34,52.55 0 top
R31  40.34,45.5 270 top
R32  39,42.83 270 top
R33  34.43,42.83 90 top
R34  14.94,52.1 270 top
R35  30.05,74.33 0 top
R36  33.48,92.36 0 bottom
R37  13.6,92.36 180 bottom
R38  30.69,78.78 180 top
R39  27.51,78.78 180 top
R40  21.92,67.22 0 top
R41  16.97,78.14 0 top
R42  43.64,42.83 90 top
R43  27.51,33.31 0 top
R44  13.03,65.57 90 top
R45  15.19,74.58 0 top
R46  3.76,32.8 180 top
SJ1  18.49,72.04 90 bottom
START  31.19,88.81 90 top
TP1  45.55,26.07 90 top
TP2  44.91,17.18 90 top
TP3  40.47,23.21 90 top
TP4  35.07,20.67 90 top
TP5  29.67,23.21 90 top
TP6  28.08,20.67 90 top
TP7  22.37,23.53 90 top
TP8  21.1,20.67 90 top
TP9  17.29,26.07 90 top
TP10  14.75,20.67 90 top
TP11  10.3,26.39 90 top
TP12  45.55,31.47 90 top
TP13  7.06,25.31 90 top
TP16  42.05,31.47 90 top
TP17  38.56,31.47 90 top
TP18  35.07,25.75 90 top
TP19  32.53,36.86 90 top
TP21  28.08,26.07 90 top
TP22  24.59,31.47 90 top
TP23  20.46,31.47 90 top
TP24  18.56,36.55 90 top
TP25  14.62,26.13 90 top
TP26  20.02,25.82 90 top
U$1  [CE_10.00]  49.86,77.63 270 bottom
X1  26.3,72.36 180 bottom
X2  43.64,12.73 0 bottom
X3  2.37,22.58 90 bottom

### Tracks (layer width: path | path; a pad name or v marks a point on that pad's centre or on a via)
+10V  (via drill 0.6)
  Top 0.406: 7.45,74.33 5.03,71.92 IC11.3 | 7.57,74.46 IC11.16 9.48,75.6 9.48,75.09 11.38,75.09 11.89,76.11 12.29,76.26 IC4.1 | 13.41,72.68 14.3,73.69 R45.2 | 7.45,71.16 7.45,71.03 7.83,70.65 IC11.13 11.26,70.65 11.89,71.41 13.03,72.68 13.41,72.68 | 7.45,71.16 7.45,74.33 | 7.45,74.33 7.57,74.46 | IC10.4 15.45,67.22 16.46,68.23 v16.46,68.74 16.46,69.89 17.61,71.03 IC10.8 | C2.1 5.79,76.23 7.57,74.46 | v13.54,73.44 13.54,72.68 13.41,72.68 | IC11.5 5.29,69.38 | 5.29,69.38 5.67,69.38 7.45,71.16 | 5.29,69.38 5.29,72.04
  Bottom 0.406: v13.54,73.44 14.3,73.44 16.46,71.28 v16.46,68.74
  pour Top: 5.03,69.38 5.03,76.87 11,76.87 11,75.47 8.46,75.47 8.08,75.09 8.08,69.5 5.16,69.5
+12V  (via drill 0.5, 0.6)  (3 unrouted)
  Top 0.35: 35.13,15.8 35.64,15.91
  Top 0.406: IC5.16 6.94,14.01 v4.14,14.01 | R2.1 41.99,22.51 41.23,21.75 R6.1 v37.04,21.24 37.04,17.31 35.64,15.91 | IC2.3 48.95,40.52 48.47,39.79 IC3.IN | R11.2 15.7,97.7 | R10.2 12.4,97.7 | 11.89,79.28 IC4.3 | R35.1 29.04,75.22 28.78,74.33 | IC6.2 13.92,91.86 14.05,91.98 | R9.2 9.1,97.7 | IC7.9 34.37,15.17 35.13,15.8 | D1.C 27.13,88.05 | 7.32,56.3 7.32,56.05 7.06,55.8 7.06,51.39 Q5.3 | Q4.3 27.9,95.94 27.13,95.17
  Top 0.5: 22.43,35.72 22.56,36.86 22.56,41.06
  Top 0.61: 2.1 TP12.TP 45.16,31.09 | 22.56,31.28 22.43,31.53 | R2.1 v42.88,25.69 | 10.75,97.7 10.75,93.25 10.24,92.36 10.24,88.17 10.44,87.16 10.44,80.73 11.89,79.28 | 28.78,74.33 27.64,73.19
  Top 0.711: 22.56,31.28 24.97,28.48 | 22.56,41.06 23.19,41.82
  Top 0.813: 24.97,28.48 v24.97,27.21 | 22.43,31.53 22.43,35.72 | 23.19,41.82 23.19,46.52 v23.45,48.04 | 25.1,71.09 25.48,72.93 26.11,74.46 | 7.32,56.3 11.87,56.27 13.13,57.06 22.3,57.06 v22.81,57.31 | 27.64,73.19 JP1.2 | 14.05,91.98 14.05,97.7
  Top 1.016: R29.2 5.92,97.7 9.1,97.7 10.75,97.7 12.4,97.7 14.05,97.7 15.7,97.7 20.53,97.7 21.16,96.68 22.43,95.79 27.13,95.79 27.13,95.17 27.13,88.05 24.34,86.37 X1.6 24.08,82.94 25.86,81.06 25.86,77.12 26.11,76.11 26.11,74.46 | 25.1,65.69 25.1,71.09
  Bottom 0.406: IC3.IN 47.96,39.28 | 45.8,34.45 45.8,34.48
  Bottom 0.61: v4.14,14.01 7.67,11.85 15.32,11.85 15.95,12.35 15.95,15.53 18.75,19.34 22.81,24.93 v24.97,27.21 27,24.16 28.65,24.16 30.94,25.94 32.34,25.94 34.37,25.69 36.15,25.69 36.78,26.83 39.7,26.83 41.1,25.69 v42.88,25.69 42.88,25.82 45.16,28.1 45.16,33.85 2.1 | 47.96,39.28 47.96,36.48 45.8,34.45 | JP1.2 25.73,70.77 25.73,67.47 24.34,65.82 v25.04,65.63
  Bottom 0.711: 22.33,59.03 22.33,64.23
  Bottom 0.813: v4.14,14.01 X3.1 | 24.34,26.45 25.23,26.45
  Bottom 1.016: v23.45,48.04 23.45,55.66 v22.81,57.31 22.33,59.03 | 22.33,64.23 v23.89,65.63
  Bottom 1.422: v23.89,65.63 v25.04,65.63
+12V1
  Top 0.406: IC1.7 R16.1 R17.1
GND  (via drill 0.6)
  Top 0.406: IC2.2@1 IC2.2
  Top 1.27: 24.27,63.79 24.27,58.14
  Bottom 0.61: X2.1 44.91,8.93 R4.2
  Bottom 1.27: v25.35,49.18 24.97,49.56 24.97,57.95 24.84,58.07 24.84,58.33 24.46,58.84 24.46,59.98
  other vias: 20.53,64.68 38.69,28.48 17.1,20.48 13.77,99.53 41.1,42.83 25.61,45.5 36.24,12.59 17.35,6.63 46.18,80.3 26.62,39.28 43.64,51.98 50.12,33.05 23.57,20.36 29.6,70.01 2.37,79.66 26.62,31.15 20.14,34.33 9.98,57.82 13.54,86.39 38.05,80.43 22.81,28.99 17.48,54.9 21.8,80.43 15.57,77.12 9.1,79.66 16.93,89.59 29.04,86.78 45.8,57.19 28.91,79.23 46.18,69.89 30.56,30.9 16.97,65.19 7.45,34.96 1.97,48.66
  pour Top (rank 3): 1.22,100.3 1.22,5.7 44.4,5.7 45.42,5.5 45.42,14.89 45.8,18.07 51.39,18.07 51.39,100.3
  pour Bottom: 1.22,100.4 1.22,5.7 51.39,5.7 51.39,100.3
N$1  (via drill 0.6)  (1 unrouted)
  Top 0.61: 39.83,94.65 38.43,93.76 v38.43,88.3 38.43,88.68
  Top 0.813: 39.83,94.65 D7.1 40.72,95.16 44.02,95.16 44.15,95.03 44.15,89.84 | D8.1 41.92,87.35 44.15,89.58 44.15,89.84 | JP2.1 44.27,89.96 44.15,89.84
  Top 1.016: 18.56,36.23 18.38,35.1 18.38,35.06 2.9
  Bottom 0.61: 23.7,44.36 24.84,46.77 28.02,47.79 28.02,54.65 26.29,57.31 26.29,63.53 27.26,64.42 28.27,64.81 30.94,65.69 30.94,71.28 30.43,72.04 30.43,75.98 30.81,77 30.81,80.43 30.18,81.19 30.18,86.27 32.46,88.55 38.18,88.55 v38.43,88.3 | 21.41,44.36 20.65,43.47 19,41.82 JP3.2
  Bottom 0.813: 23.7,44.36 21.41,44.36 | 2.9 17.16,35.54 17.16,41.76 18.68,41.76 JP3.2
N$2  (via drill 0.6)
  Top 0.406: v11.89,20.04 12.14,19.99 12.65,19.48 12.65,16.68 13.3,16.04 13.92,15.78 14.56,15.28 IC5.10 | IC6.1 15.13,90.53 15.7,90.59 | 15.7,90.59 R11.1 | 15.7,90.59 15.83,90.2 15.83,88.68 16.59,88.3 16.59,83.56 X1.4
  Bottom 0.406: 6.48,64.74 6.48,58.71 6.43,55.41 6.43,34.45 7.83,32.42 7.95,32.29 9.54,29.37
  Bottom 0.61: X1.4 16.34,83.15 16.34,80.2 6.48,67.12 6.48,64.74 | 9.54,29.37 12.34,24.74 12.34,22.51 v11.89,20.04 11.95,19.97 11.95,16.42 11.06,14.77 7.83,14.77 4.59,16.23 4.59,19.4 3.95,20.04 X3.2
N$3  (via drill 0.6)
  Top 0.406: IC5.13 10.75,15.21 9.03,16.86 v9.03,17.18 | 12.65,88.12 IC6.4 12.65,88.05 11.89,88.05 11.76,87.92 | 11.68,85.72 11.68,87.83 11.76,87.92 | R10.1 12.4,93.38 11.26,92.24 11.26,88.43 11.76,87.92
  Top 0.61: X1.3 11.68,85.72
  Bottom 0.406: 4.78,65.76 2.75,63.98 2.75,57.76 4.91,52.3 4.91,26.39 5.92,25.24 8.21,22.51 8.21,21.37 8.96,19.88 | v9.03,17.18 8.97,17.62 8.97,19.21 8.96,19.88 | 4.91,22.26 6.49,20.67 8.55,20.67 8.96,19.88
  Bottom 0.61: X1.3 12.21,82.98 12.21,77.44 4.78,67.98 4.78,65.76 | X3.3 4.59,22.58 4.91,22.26
N$4  (1 unrouted)
  Top 0.406: 2.7 23.32,36.23 23.32,39.53 24.55,40.51
  Top 0.61: TP22.TP 24.59,34.2 2.7 | 24.55,40.51 LED1.A
  Bottom 0.406: 30.3,63.73 30.3,59.09
  Bottom 0.61: X1.8 32.24,80.4 34.75,78.14 39.61,73.28 39.61,68.45 30.3,63.73 | 30.3,59.09 30.3,45.12 24.84,40.8 24.72,40.67 24.65,40.48
N$5
  Top 0.305: 47.07,29.12 47.07,21.78
  Top 0.406: Q1.3 47.07,29.12 | 47.07,21.78 45.93,21.24 43.39,21.24 43.13,20.99
  Top 0.61: 43.13,20.99 R2.2
N$6  (via drill 0.6)
  Top 0.406: 25.99,43.47 D11.2 27.82,44.28 28.91,45.12 34.24,45.12 v36.78,46.01 38.56,47.53 IC8.2 | Q7.1 34.12,75.6 34.12,73.76 | 34.12,73.76 34.12,73.31 34.24,73.06 34.24,71.92 33.99,71.54 33.35,70.65 | v40.85,56.8 40.85,57.58 39.83,58.47 38.56,59.34 38.56,63.41 39.83,64.93 39.83,67.47 v37.8,69 | R35.2 30.94,73.5 31.32,73.76 34.12,73.76
  Top 0.813: 33.35,70.65 JP5.1
  Bottom 0.406: v36.78,46.01 36.78,49.95 40.85,56.17 v40.85,56.8 | v37.8,69 35.26,69 JP5.1
N$7
  Top 0.406: IC1.2 45.8,72.17 46.81,73.19 R7.2
N$8
  Top 1.27: R27.2 R29.1
N$9  (via drill 0.6)
  Top 0.406: v46.43,19.21 46.94,18.2 Q2.3 | 37.42,16.29 v37.67,16.42 | 38.31,17.43 R6.2
  Top 0.61: v37.67,16.42 38.31,17.43
  Bottom 0.406: v37.67,16.42 37.54,16.42 39.32,19.97 41.1,21.5 43.64,21.5 45.67,19.21 v46.43,19.21
N$10
  Top 1.016: 24.59,92.38 22.43,92.38
N$11  (via drill 0.6)
  Top 0.406: Q4.2 30.43,91.98
  Top 0.61: START.TP v29.54,90.2
  Top 0.813: v29.54,90.2 30.43,91.98 | D5.2 19,91.22 18.88,89.44 18.88,87.09 20.46,83.47 X1.5
  Bottom 0.813: X1.5 20.36,84.2 22.94,86.9 26.5,86.9 28.27,88.55 29.42,90.08 v29.54,90.2
N$12  (1 unrouted)
  Top 0.61: TP16.TP 2.2 | 48.34,82.97 48.34,91.49 48.72,91.87 48.72,93.9 46.94,96.69 46.94,98.22 45.42,99.54 41.35,99.54 40.85,99.23 D9.2
  Bottom 0.711: 46.1,63.66 46.1,59.47
  Bottom 0.813: X1.12 48.09,83.21 48.09,79.66 48.47,78.78 48.47,65.06 46.1,63.66 | 46.1,59.47 46.1,59.09 47.32,58.2 47.32,46.01 43.64,40.55 43.64,38.64 LED2.K 2.2
N$13  (1 unrouted)
  Top 0.61: TP17.TP 2.3 | X1.11 44.88,85.22 45.67,86.9 D8.2
  Bottom 0.406: 37.37,38.05 37.19,38.52 37.19,42.07 35.51,43.34
  Bottom 0.61: 38.56,38.05 37.37,38.05 | 35.51,43.34 35.51,50.52 39.58,56.68 39.58,57.82 40.08,58.2 40.85,58.2 42.13,59.1 42.13,59.27
  Bottom 0.711: 42.13,59.27 42.13,64.03
  Bottom 0.813: 2.3 38.56,38.05 | 42.13,64.03 42.13,64.44 42.75,66.46 42.75,77 44.15,78.39 44.15,79.56 X1.11
N$14  (1 unrouted)
  Top 0.61: TP18.TP 35.07,28.72 2.4 | X1.10 40.16,82.72 40.15,82.71 40.15,84.44 40.08,84.83 D7.2
  Bottom 0.406: 34.5,42.96 36.38,41.56 36.38,38.39 35.07,38.07
  Bottom 0.61: 38.19,57.19 34.5,51.47 34.5,42.96
  Bottom 0.711: 38.19,64.49 38.19,57.19
  Bottom 0.813: X1.10 40.15,83.2 40.15,78.84 41.61,76.49 41.61,66.9 38.19,64.49 | 35.07,38.07 35.05,30.82 2.4
N$15
  Top 0.406: Q5.2 8.59,48.3 8.84,48.3
  Top 0.813: IC9.3 8.84,48.3
N$16
  Top 0.406: 43.64,50.48 44.91,50.48 IC8.8 | 43.64,50.48 IC8.6 | 43.64,50.48 42.6,50.48 41.1,51.98 36.53,51.98 35.13,52.99 35.13,53.25 34.88,53.5 33.35,54.77 31.19,54.77 30.81,54.39 30.81,53.63 30.05,52.49 26.11,52.49 25.1,53.5 R20.1
N$17  (via drill 0.6)
  Top 0.406: IC5.12 12.02,15.21 10.3,16.86 10.3,18.45 8.71,21.31 v7.13,21.94 | R9.1 9.1,90.33 8.59,89.82 8.59,86.27 | IC6.3 12.97,91.22 v12.4,91.86
  Top 0.61: 8.59,86.27 8.59,83.47 X1.2
  Bottom 0.406: 3,66.46 2.01,65.57 2.01,56.61 4.08,51.6 4.08,25.43 v7.13,21.94 | v12.4,91.86 12.4,89.57 8.59,85.76 8.59,83.47 X1.2
  Bottom 0.61: X1.2 8.4,83.13 8.14,81.06 4.78,78.27 4.78,74.08 3,69.12 3,66.46 | X3.4 2.37,25.43 4.08,25.43
N$18
  Top 0.406: IC5.15 8.21,12.1 9.22,11.21 16.72,11.21 17.7,10.85 29.04,10.85 30.56,9.71 IC7.5
N$19
  Top 0.406: 20.61,31.61 21.41,31.7 21.41,37.82 21.24,37.82 LED6.K | 17.46,38.01 16.57,39.2 D10.2
  Top 0.61: LED6.K 17.46,38.01
  Top 1.016: 2.8 TP23.TP 20.61,31.61
  Bottom 0.61: 7.57,38.13 12.27,35.91 12.27,34.64 13.03,33.88 13.54,33.5 16.4,30.71 19.76,30.71 | 20.78,29.73 2.8
  Bottom 0.813: X1.14 8.48,57.42 7.57,55.28 7.57,38.13 | 19.76,30.71 20.78,29.73
N$20  (via drill 0.81)  (1 unrouted)
  Top 0.813: 15.57,36.61 14.43,37.5 14.43,41.06 v13.79,41.95 12.42,43.72
  Top 1.016: 1.9 17.55,25.81 TP9.TP 17.11,30.06 15.7,31.79 15.7,35.72 15.57,36.61
  Bottom 0.813: X1.17 20.36,58.37 20.65,57.69 21.54,56.04 22.05,55.03 22.05,47.66 20.4,46.14 15.95,46.14 v13.79,41.95
N$21  (via drill 0.6)
  Top 0.61: 8.84,35.66 6.43,37.31 6.43,42.88 6.81,43.72 | 6.81,43.72 9.86,43.72 11.26,45.82 20.14,45.82 21.22,44.67 v21.73,42.39 | D3.1 6.81,43.72
  Top 1.016: 8.84,35.66 8.84,32.67 10.3,31.09 TP11.TP 10.62,26.07 10.62,24.2 1.11
  Bottom 0.61: X1.19 28.28,58.02 29.16,55.53 29.16,46.07 24.84,42.39 v21.73,42.39
N$22  (1 unrouted)
  Top 0.406: IC11.11 7.95,68.11 7.45,67.6 7.45,66.08 | 7.45,66.08 7.95,65.57 IC11.9 | 7.45,66.08 7.19,66.08 6.5,65.44 6.5,59.09 | R46.2 3.76,34.26 5,35.5 5,43.2 3.5,44.7 3.5,56 6.5,59.1
N$23  (via drill 0.6)
  Top 0.406: X1.22 40.16,59.34 42.57,57.13 43.97,57.13 46.1,59.09 46.1,64.42 47.39,65.89 | 47.39,65.89 R5.2 | v44.66,64.81 46.06,64.42 47.39,65.89
  Bottom 0.406: D4.C 45.29,67.34 45.16,67.34 44.66,66.84 v44.66,64.81
N$24  (1 unrouted)
  Top 0.406: 49.74,74.71 49.74,69.76 48.21,68.74 R5.1 | IC1.3 45.55,73.44 46.94,74.84 48.21,74.84 | 48.21,74.84 49.74,74.84 | C1.1 48.21,74.84
N$25
  Top 0.406: IC7.13 29.29,15.91
  Top 0.61: TP6.TP 28.08,17.97 1.6 28.02,17.43 28.4,16.8 29.29,15.91
N$26
  Top 0.406: 1.7 26.07,20.73 26.11,16.93 28.02,15.53 IC7.14
  Top 0.61: TP7.TP 24.46,23.53 1.7
N$27  (via drill 0.6, 0.8)  (3 unrouted)
  Top 0.406: TP26.TP 19.64,26.07 19.13,27.59 | 34.24,62.9 32.72,64.42 30.94,64.42 | 30.94,64.42 30.69,64.42 29.54,65.31 R19.1 | IC7.16 25.48,14.28 | R18.2 30.94,64.42
  Top 0.61: 19.13,27.66 v18.88,29.12 | 25.48,14.28 v23.83,14.28 | v35.13,57.31 35.13,58.09 34.24,58.98 34.24,62.9
  Bottom 0.406: 17.86,27.98 16.97,28.86 14.18,31.53 12.91,32.04 | 33.16,38.07 33.71,38.9 33.71,41.56 33.61,41.95
  Bottom 0.508: 17.86,27.98 19,27.21 | 33.16,32.29 33.16,38.07 | 33.61,41.95 33.61,51.72 35.12,57.32
  Bottom 0.61: 33.16,32.29 32.02,30.26 30.18,27.09 29.29,26.2 27.13,26.2 25.48,28.74 23.95,28.74 22.94,26.7 21.92,26.07 20.14,26.07 19,27.21 v18.88,29.12 | 2.11 10.71,34.23 12.91,32.04
N$28  (via drill 0.6)
  Top 0.406: v28.78,40.55 29.16,39.66 29.16,30.9 28.05,29.78 2.6 | v31.96,57.57 30.18,59.34 30.18,63.41 29.42,64.17 26.37,64.17 26.37,67.73 26.3,68.23 26.3,70.84 26.75,71.35 30.94,71.35 | JP5.2 32.46,72.42
  Top 0.61: TP21.TP 28.08,28.7 2.6 | 32.46,72.42 30.94,71.35
  Bottom 0.406: v31.96,57.57 31.96,56.04 31.7,55.79 31.7,44.36 v28.78,40.55
N$29
  Top 0.61: JP1.1 R19.2
N$30
  Top 0.406: R22.2 C5.1 48.09,55.28 | IC8.9 43.77,55.41 44.4,55.91 46.56,55.91 47.2,55.28 48.09,55.28 | 48.09,55.28 R23.2
N$31
  Top 0.406: IC8.14 37.22,54.65 36.02,54.65 33.99,56.17 29.92,56.17 29.16,55.53 | R26.2 29.16,55.53 | 29.16,55.53 C6.2
N$32
  Top 0.305: 20.02,72.04 20.53,71.54 20.53,68.81 20.14,68.49
  Top 0.406: IC10.2 15.06,69.76 17.35,72.04 20.02,72.04 20.02,72.93 20.46,73.69 20.46,75.43 22.64,77.02 23.19,77.78 D12.2 23.36,79.03 C9.2 R41.1 16.21,79.16 14.73,80.68 14.73,85.51 14.87,85.69 15.19,86.27 15.45,86.65 15.32,86.9 14.87,87.48 IC6.6 | 20.14,68.49 IC10.6
N$34
  Top 0.61: LED1.K 25.95,36.38 R43.1
N$35
  Top 0.406: R20.2 19.09,53.5 IC9.1
  Top 0.61: R34.1 16.44,53.4 IC9.1
  Bottom 0.711: 18.39,58.84 18.39,64.36
  Bottom 0.762: 24.16,68.36 24.16,74.84
  Bottom 0.813: 18.39,58.84 19.51,56.42 IC9.1 | 20.42,67.62 24.16,68.36
  Bottom 1.016: 18.39,64.36 20.42,67.62 | X1.7 28.38,83.12 28.38,80.52 27.13,79.66 26.37,77.89 24.16,74.84
N$36
  Top 0.406: R26.1 25.61,56.04 13.67,56.04 11.1,54.75 11.1,52.18 10.9,51.98 Q5.1
N$37  (via drill 0.6)
  Top 0.406: IC5.2 8.21,9.24 v5.03,10.83 | IC7.7 33.1,10.21 v32.84,10.47
  Bottom 0.406: 5.67,10.83 7.32,9.56 18.24,9.56 18.79,10.01 20.95,10.01 21.41,6.66 32.84,6.66 v32.84,10.47
  Bottom 0.61: v5.03,10.83 5.67,10.83
N$38
  Top 0.406: 1.3 38.04,22.89 34.88,22.89 33.35,21.37 33.35,18.83 31.83,15.55 IC7.11
  Top 0.61: TP3.TP 38.78,23.21 1.3
N$39
  Top 0.406: 1.5 31.55,20.84 31.45,20.74 31.45,18.45 31.19,17.94 31.19,17.05 30.56,15.55 IC7.12
  Top 0.61: 1.5 29.9,23.44 TP5.TP
N$41
  Top 0.61: LED2.A 42.37,40.55 42.88,41.06 42.88,42.64 R42.1 | LED3.A LED4.A LED5.A
  Bottom 0.508: 25.73,36.61 23.7,36.61
  Bottom 0.61: LED2.A LED3.A | 25.73,36.61 26.11,36.61 29.8,38.77 LED5.A | 23.7,36.61 22.56,37.5 22.56,39.04 LED6.A
N$42
  Top 0.406: X1.16 16.4,63.47 16.46,63.53 20.65,66.08 21.29,66.08 R40.2
N$43
  Top 0.406: R28.2 32.46,90.59 32.46,94.14 Q4.1
N$44  (via drill 0.6)
  Top 0.406: IC7.2 IC7.1 24.82,7.8 22.55,7.8 | 22.55,7.8 19.54,7.8 16.59,10.32 10.37,10.32 9.48,9.43 IC5.3 | Q6.1 19.13,12.99 v18.37,12.99 | v22.55,8.59 22.55,7.8
  Bottom 0.406: v18.37,12.99 22.55,10.7 v22.55,8.59
N$45
  Top 0.406: C7.1 31.22,48.62 R25.1 R30.2
N$46
  Top 0.406: IC8.4 41.1,50.71 40.34,51.22 36.02,51.22 33.99,52.74 33.23,53.37 R30.1 31.55,53.12 C8.1
N$47
  Top 0.406: R33.2 R32.2 38.43,43.6 38.94,44.1 40.59,44.1 R31.1 42.37,46.01 IC8.5
N$48
  Top 0.406: R38.2 30.69,79.79 33.1,79.79 Q7.3
N$49
  Top 0.406: R33.1 33.48,43.22 31.27,43.22 D11.1
N$50  (via drill 0.6)
  Top 0.406: IC7.4 29.29,9.52 28.65,9.96 22.24,9.96 v19.89,9.07
  Top 0.61: v5.53,8.29 6.94,8.29 IC5.1
  Bottom 0.406: v19.89,9.07 19.89,8.74 19.84,8.68
  Bottom 0.61: 19.84,8.68 19.7,8.67 5.94,8.67 v5.53,8.29
N$51
  Top 0.61: R15.1 36.27,59.28 X1.21
N$52
  Top 0.406: 21.1,17.89 1.8 20.8,17.05 Q6.3 | 21.22,20.67 TP8.TP
  Top 0.61: TP8.TP 21.1,17.99 | 21.1,17.81 21.1,17.99 | 21.1,17.99 1.8
N$53  (via drill 0.6)
  Top 0.61: TP25.TP 14.11,28.8
  Top 0.813: v14.11,35.59 14.11,28.8 2.10
  Bottom 0.813: X1.15 9.54,41.56 9.54,39.28 13.41,37.5 14.11,36.1 v14.11,35.59
N$54
  Top 0.813: D6.1 36.78,96.68 37.92,96.69
  Top 1.27: 37.92,96.69 41.48,96.69 R27.1
N$55
  Top 0.61: TP19.TP 32.44,36.86 31.55,35.98 2.5 | X1.9 36.53,85.2 36.53,90.02 D6.2
  Bottom 0.406: LED5.K 32.87,39.22 32.87,41.44 32.59,41.82 | 34.27,58.93 34.27,62.17 34.24,63.92
  Bottom 0.61: 2.5 LED5.K | 32.59,41.82 32.59,52.08 33.35,55.28 33.35,57.06 34.27,58.74 34.27,58.93 | X1.9 36.27,83.08 36.27,78.9 40.59,74.33 40.59,67.73 34.24,63.92
N$56  (1 unrouted)
  Top 0.406: IC5.14 9.48,12.73 10.11,12.1 16.97,12.1 17.99,11.74 29.54,11.74 31.83,9.83 31.83,8.05
N$57  (via drill 0.6)  (1 unrouted)
  Top 0.406: Q1.1 50.75,29.12 50.75,18.91 Q2.1 | 42.37,13.62 X2.2
  Top 0.61: 42.37,10.83 X2.2 40.5,13.84 R3.1 | 42.37,10.83 v42.31,10.51 | 42.37,10.83 42.37,8.99 R1.1 | 43.89,14.89 42.37,13.62 | Q2.1 48.72,17.33 Q2.2 | 48.47,14.89 48.47,11.72 | 50.24,14.13 48.21,14.13 | 48.72,13.37 46.69,13.37
  Top 0.813: 48.47,14.89 43.89,14.89
  Bottom 0.61: X2.2 v42.31,10.51 42.05,8.93 | 41.93,8.54 R4.1
  pour Top: 46.18,18.2 46.18,7.02 51.26,7.02 51.26,18.2
N$58
  Top 0.406: R18.1 32.21,67.48 33.23,66.47 Q3.2 | R15.2 38.69,57.96 37.8,58.85 37.8,65.31 36.66,66.46
  Top 0.61: 36.66,66.46 Q3.2
N$59
  Top 0.406: Q1.2 48.72,21.5 45.16,19.97 45.16,17.43 TP2.TP
  Top 0.61: TP2.TP 42.88,17.3 42.24,17.3 1.2 | 49.61,26.07 49.61,24.67 | 47.83,26.07 47.83,24.67
  pour Top: 47.45,28.86 47.45,22.01 46.18,20.74 40.85,20.48 40.85,15.66 41.86,15.4 43.89,15.66 45.93,18.2 46.18,18.2 46.69,18.83 50.5,18.83 50.5,28.86
N$61  (1 unrouted)
  Top 0.305: 28.02,8.18 28.02,6.53 24.59,6.53 24.08,6.91
  Top 0.406: 24.08,6.91 18.96,6.91 16.27,9.48 13.29,9.48 IC5.6
N$63
  Top 1.422: 24.97,65.57 23.83,65.57
N$64
  Top 0.61: IC9.2 R34.2
N$65
  Top 0.406: R44.2 15.32,65.57 16.21,66.33 17.28,67.22 IC10.5
N$67
  Top 0.406: IC7.10 33.1,15.55 33.61,16.18 34.16,17.05 1.4
  Top 0.61: TP4.TP 35.07,17.96 1.4
N$69
  Top 0.61: TP1.TP 1.1
  Bottom 0.61: 49.67,41.25 49.67,35.09
  Bottom 1.016: X1.1 4.59,85.51 6.17,87.41 6.75,87.41 12.27,95.41 39.7,95.41 39.7,90.2 41.48,87.92 49.29,87.92 50.88,87.03 50.88,57.38 50.12,54.26 50.12,44.87 49.67,41.25 | 49.67,35.09 48.02,33.25 48.02,27.57 1.1
N$83
  Top 0.406: 47.96,49.95 46.56,49.95 IC8.7 | 47.77,51.03 R22.1 47.96,51.22 47.96,49.95 | 47.96,49.95 47.96,48.93 R21.1
N$85
  Top 0.406: Q3.1 35.24,69.24 36.02,70.15 R16.2
N$86
  Top 0.406: R44.1 11.89,65.95 11.89,68.49 | 11.89,68.49 IC10.3 | IC11.12 11,69.38 11.89,68.49
N$87
  Top 0.406: R40.1 23.64,68.11 23.64,73.44 23.95,74.33 D12.1
N$88  (via drill 0.6)
  Top 0.406: IC7.15 26.88,14.43 26.68,15.31 25.41,16.37 v24.34,16.93 | R28.1 v33.99,86.27
  Bottom 0.406: v24.34,16.93 26.11,19.47 26.11,20.48 26.88,21.24 29.67,21.24 30.43,20.48 31.96,20.48 35.77,24.29 36.27,24.29 37.8,25.82 39.2,25.82 40.97,24.04 42.88,24.04 46.94,28.1 46.94,34.2 48.85,36.23 48.85,40.43 48.34,41.07 48.34,56.82 49.61,58.47 49.61,58.45 49.86,58.84 49.86,86.01 48.72,86.78 35,86.78 v33.99,86.27
N$89
  Top 0.406: IC11.14 11,71.92 12.65,74.58 14.05,74.58 R45.1 | 15.45,75.47 R45.1 | C10.1 17.48,73.69 16.08,75.47 R45.1
N$90  (via drill 0.5)
  Top 0.254: R46.1 5.79,32.67 v5.92,32.8 5.79,32.93 3.76,33.69
  Top 0.406: TP13.TP 7.06,28.73 2.12 6.79,28.99 5.67,28.99 3.76,30.9 R46.1
N$92
  Top 0.406: IC1.1 42.75,70.9 42.12,71.54 R8.2
N$93  (via drill 0.6)
  Top 0.813: D3.2 10.24,40.25 D2.2 12.4,39.28 v10.87,40.42
  Top 1.016: 1.10 TP10.TP 14.68,23.02 13.16,24.54 12.21,27.4 12.21,31.15 12.53,31.47 12.53,37.25 10.24,37.75
  Top 1.93: 10.24,37.75 10.24,40.25
  Bottom 0.61: 18.49,68.73 18.76,68.73 | SJ1.1 18.49,70.01 19.27,69.24
  Bottom 0.711: 14.43,59.22 14.43,64.55
  Bottom 0.813: v10.87,40.42 10.87,41.82 14.43,59.22 | 14.43,64.55 18.39,68.36 18.76,68.73 19.27,69.24 20.04,70.01 JP4.1
N$94
  Bottom 0.61: 18.88,74.49 18.49,73.6 SJ1.2
  Bottom 0.813: 23.7,92.36 R36.2 | 23.7,92.36 R37.2 | JP4.2 20.78,72.55 18.88,74.49 18.37,74.97 18.37,86.39 23.7,91.6 23.7,92.36
N$95  (via drill 0.6)
  Top 0.813: D9.1 32.21,98.73 v31.7,99.23
  Bottom 0.813: v31.7,99.23 31.96,99.23 32.21,99.49 41.1,99.49 41.35,99.74 44.66,99.74 47.96,96.44 47.96,94.02 JP2.2
N$96
  Top 0.406: C3.1 R8.1 R12.1
N$97
  Top 0.406: IC1.5 39.01,74.9 38.18,75.73 | 38.18,75.73 37.54,76.36 35.64,76.36 R17.2 | R12.2 39.32,76.87 38.18,75.73
N$98
  Top 0.406: 16.48,43.22 16.48,43.68 D10.1
  Top 0.61: JP3.1 16.89,44.36 D10.1
N$99
  Top 0.406: 30.69,76.62 31.57,76.23 | R38.1 30.69,76.62 | 30.69,76.62 28.02,76.62 27.51,77 R39.1
  Top 0.813: 31.57,76.23 JP5.3
N$101
  Top 0.406: R13.1 42.5,66.58 44.15,68.23 44.78,68.23 R14.2 44.15,68.36 43.13,69.76 41.86,69.76 41.1,70.52 41.1,72.81 40.59,73.31 39.13,73.31 IC1.6
N$580  (1 unrouted)
  Top 0.406: IC8.1 36.15,48.68 35.07,48.3 R24.2 33.73,48.3 33.35,47.53 33.23,47.28 R25.2
VCC  (via drill 0.6)
  Top 0.406: R24.1 35.07,50.26 36.15,50.43 39.83,50.43 IC8.3 39.83,46.64 39.32,46.14 39.32,46.07 R31.2 | R21.2 48.97,47.41 46.31,47.41 45.17,46.27 45.04,46.27 | IC2.1 45.57,41.47 45.16,40.93 | R13.2 40.72,68.36 | 40.72,68.36 39.07,70.01 39.07,70.84 IC1.8 | 40.72,68.36 40.72,65.57 42.12,64.17 42.12,58.84 v43.39,58.07 | 6V.TP 44.02,37.63 45.1,38.71
  Top 0.61: v38.18,45.12 R31.2 | 44.4,40.93 44.4,42.83 | 44.4,42.83 44.4,44.36 | C4.1 45.1,38.71 45.16,38.77 | R42.2 44.4,42.83
  Top 0.813: 44.4,40.93 45.16,40.93 IC3.OUT 45.16,38.77 | 44.4,44.36 44.4,45.63 | 44.4,45.63 v44.27,45.5 | 45.04,46.27 44.4,45.63
  Bottom 0.406: v43.39,58.07 43.39,55.91 44.66,54.26 45.04,53.88 45.04,47.15 44.27,46.39 v44.27,45.5
  Bottom 0.61: v44.27,45.5 38.69,45.5 v38.18,45.12

### Text on the board
Top: top
Bottom: BEP V3.2 / maru-labs.com
tPlace: 3 | 1 | b | c | a | 4 | 2 | 5 | 5 | 4 | 3 | 1 | 2
bPlace: QC
tNames: 78L10 | BSS138 | < / / > / / G5 / / G3 / / G1 / / / BAT | GND / / <> / / N / / G4 / / G2 / / CC | BSS138 | N | N
bNames: 1 BAT / 2 GC / 3 GB / 4 GA / / / 7 RES / 8 ABS / 9 ALT / 10 TMP / OIL | enable / Choke / on WRN | OFF/ ON | CHK | BL <> / Resistor | GND / BT / HiB | 18 | 19 | 13 / 14 / 15 / 16 / 17 / / / / 21 SPDin / 22 SPDout / 23 / 24 | RPM | enable / Bulb Test / on WRN / ON / OFF | ALT / TMP / OIL / CHK / SWP | WRN | 2.7 / 2.6 | 2.12 / 2.11 / 2.10 / / / / / 2.5 / 2.4 / 2.3 / 2.2 / 2.1 | RPM / SPD / HiB | GND c b a 12V | 1.12 GND / 1.11< / 1.10<> / 1.9 > / 1 8 N / 1.7 G5 / 1.6 4 / 1.5 G3 / 1.4 G2 / 1.3 G1 | 1.2 CC | 1.1 BAT
tValues: SS12 | M7 | M7 | SS12 | SS12 | 1 BAT / 2 GC / 3 GB / 4 GA / 5 START / 6SWP / 7RES / 8 ABS / 9ALT / 10 TMP / 11OIL / 12CHK | M7 | 13 GND / 14 BT / 15 HiB / 16RPM / 17 > / 18 GND / 19 < / / 21SPD in / 22SPD out / 23 GND | 6,8 | 4 | 4.7V | M7 | M7 | M7 | 6V | SS12 | SPD / / WRN / / ABS / / ALT / / OIL / / SWP | 2.4/1.1V | RPM / / HiB / / BT / / BAR / / TMP / / CHK | BA | BA
bValues: 2.2 kOhm / SPD / Pull-up / (Middle / Switch ) | OFF ON | OFF/ ON | BAR/RES | Mode / Selector | > | > | BAR/RES | ABS | BT
bStop: BEP V3.2 / maru-labs.com